# Altium schematic sheet rotor.SchDoc
size A4; SheetNumber: 1; SheetTotal: 1
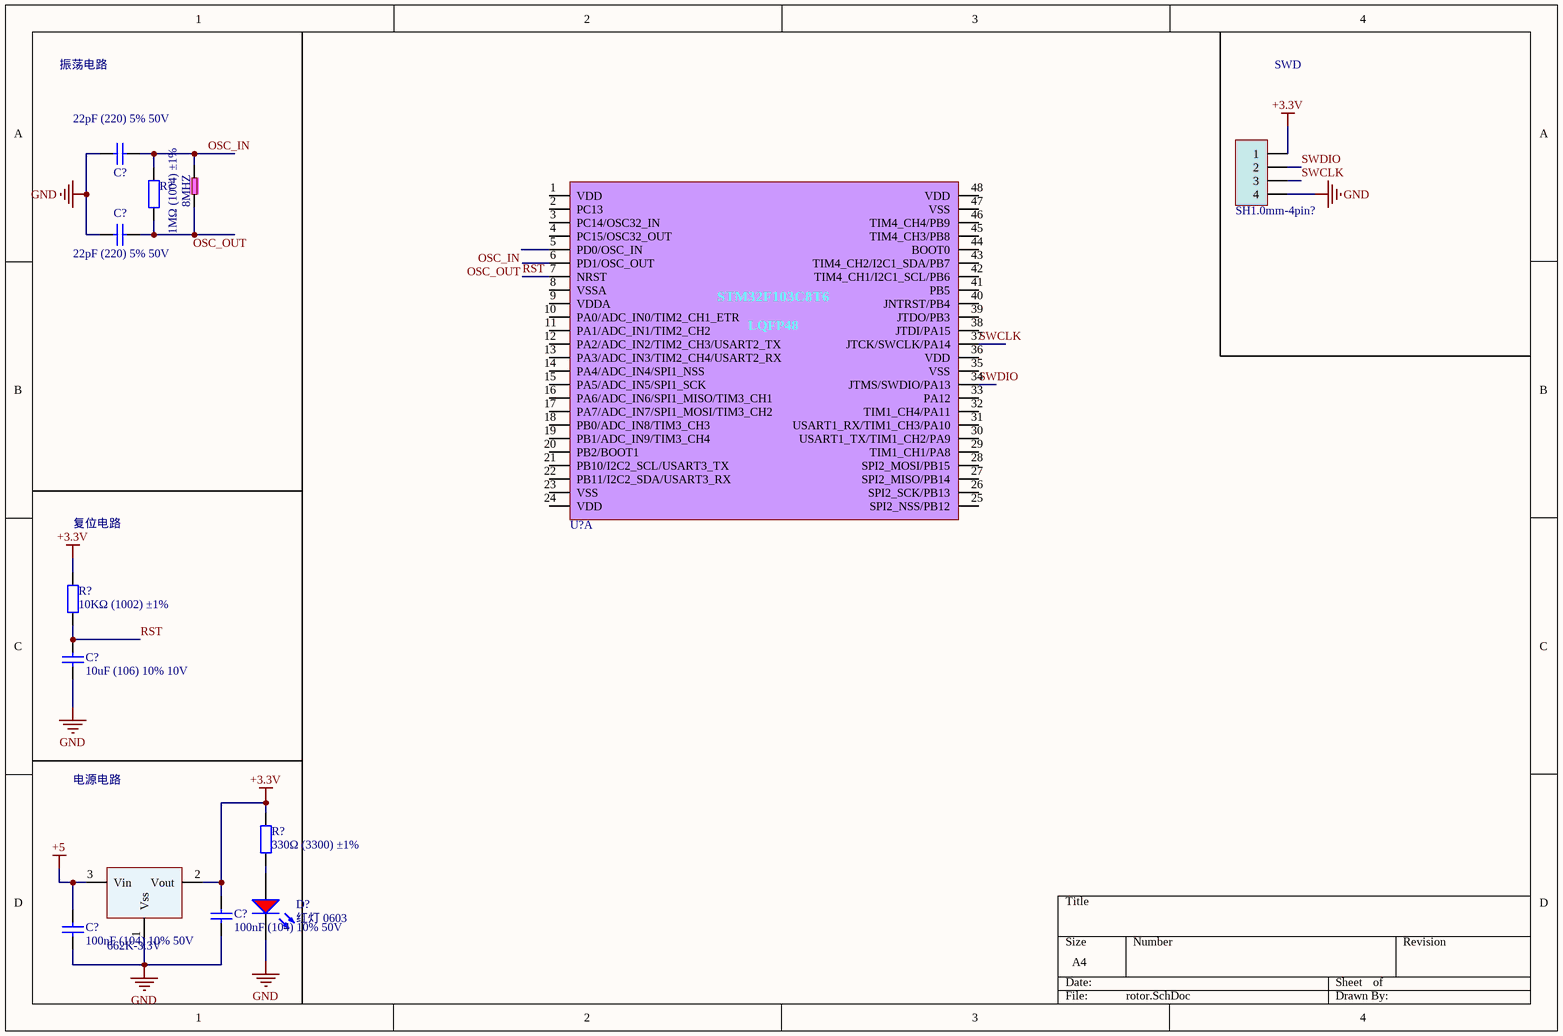
[diagram p0: rotor.SchDoc]

## Parts
(Parts that share a designator on the sheet are numbered #1, #2 ... from top to bottom, then left to right.)
8MHZ  5032-8MHZ  [5032-8MHZ]  (value not drawn)
662K-3.3V  662K-3.3V(SOT-23-3)  [SOT-23-3]  (value not drawn)
C?#1  22pF (220) 5% 50V  [0603_C]
C?#2  22pF (220) 5% 50V  [0603_C]
C?#3  10uF (106) 10% 10V  [0603_C]
C?#4  100nF (104) 10% 50V  [0603_C]
C?#5  100nF (104) 10% 50V  [0603_C]
D?  红灯 0603  [0603_LED_S1]
R?#1  1MΩ (1004) ±1%  [0603_R]
R?#2  10KΩ (1002) ±1%  [0603_R]
R?#3  330Ω (3300) ±1%  [0603_R]
SH1.0mm-4pin?  SH1.0mm-4PIN  [SH1.0mm-4PIN]  (value not drawn)
U?A  STM32F103C8T6  [STM32F103C8T6]  (value not drawn)

## Nets
+3.3V: 662K-3.3V.2(Vout) C?#4.2 R?#2.2 R?#3.2 SH1.0mm-4pin?.1
+5: 662K-3.3V.3(Vin) C?#5.2
GND: 662K-3.3V.1(Vss) C?#1.1 C?#2.1 C?#3.1 C?#4.1 C?#5.1 D?.K SH1.0mm-4pin?.4
OSC_IN: 8MHZ.3 C?#1.2 R?#1.2 U?A.5(PD0/OSC_IN)
OSC_OUT: U?A.6(PD1/OSC_OUT)
RST: C?#3.2 R?#2.1 U?A.7(NRST)
SWCLK: SH1.0mm-4pin?.3 U?A.37(JTCK/SWCLK/PA14)
SWDIO: SH1.0mm-4pin?.2 U?A.34(JTMS/SWDIO/PA13)
Net8MHZ_1: 8MHZ.1 C?#2.2 R?#1.1
NetD?_A: D?.A R?#3.1

Not connected (* = marked no-connect by the designer): U?A 1(VDD) 2(PC13) 3(PC14/OSC32_IN) 4(PC15/OSC32_OUT) 8(VSSA) 9(VDDA) 10(PA0/ADC_IN0/TIM2_CH1_ETR) 11(PA1/ADC_IN1/TIM2_CH2) 12(PA2/ADC_IN2/TIM2_CH3/USART2_TX) 13(PA3/ADC_IN3/TIM2_CH4/USART2_RX) 14(PA4/ADC_IN4/SPI1_NSS) 15(PA5/ADC_IN5/SPI1_SCK) 16(PA6/ADC_IN6/SPI1_MISO/TIM3_CH1) 17(PA7/ADC_IN7/SPI1_MOSI/TIM3_CH2) 18(PB0/ADC_IN8/TIM3_CH3) 19(PB1/ADC_IN9/TIM3_CH4) 20(PB2/BOOT1) 21(PB10/I2C2_SCL/USART3_TX) 22(PB11/I2C2_SDA/USART3_RX) 23(VSS) 24(VDD) 25(SPI2_NSS/PB12) 26(SPI2_SCK/PB13) 27(SPI2_MISO/PB14) 28(SPI2_MOSI/PB15) 29(TIM1_CH1/PA8) 30(USART1_TX/TIM1_CH2/PA9) 31(USART1_RX/TIM1_CH3/PA10) 32(TIM1_CH4/PA11) 33(PA12) 35(VSS) 36(VDD) 38(JTDI/PA15) 39(JTDO/PB3) 40(JNTRST/PB4) 41(PB5) 42(TIM4_CH1/I2C1_SCL/PB6) 43(TIM4_CH2/I2C1_SDA/PB7) 44(BOOT0) 45(TIM4_CH3/PB8) 46(TIM4_CH4/PB9) 47(VSS) 48(VDD)

## Notes on the sheet
- 振荡电路
- SWD
- 复位电路
- 电源电路
- Labels drawn without touching a wire or pin: OSC_OUT
- (in symbol STM32F103C8T6) LQFP48

## Library data of the parts
C?#1 C?#2 = 0603 22pF (220) 5% 50V: 贴片电容; ComponentLink1Description: 供应商链接; ComponentLink1URL: http://www.szlcsc.com/product/details_2005.html; Package: 0603; Supplier: LC; SuppliersPartNumber: C1653
C?#3 = 0603 10uF (106) 10% 10V: 贴片电容; ComponentLink1Description: 供应商链接; ComponentLink1URL: http://www.szlcsc.com/product/details_20411.html; Package: 0603; Supplier: LC; SuppliersPartNumber: C19702
C?#4 C?#5 = 0603 100nF (104) 10% 50V: 贴片电容; ComponentLink1Description: 供应商链接; ComponentLink1URL: http://www.szlcsc.com/product/details_15331.html; Package: 0603; Supplier: LC; SuppliersPartNumber: C14663
D? = 0603 红灯: 发光二极管; ComponentLink1Description: 供应商链接; ComponentLink1URL: http://www.szlcsc.com/product/details_2659.html; Package: 0603; Supplier: LC; SuppliersPartNumber: C2286
R?#1 = 0603 1MΩ (1004) 1%: 贴片电阻; ComponentLink1Description: 供应商链接; ComponentLink1URL: http://www.szlcsc.com/product/details_23662.html; Package: 0603; Supplier: LC; SuppliersPartNumber: C22935
R?#2 = 0603 10KΩ (1002) 1%: 贴片电阻; ComponentLink1Description: 供应商链接; ComponentLink1URL: http://www.szlcsc.com/product/details_26547.html; Package: 0603; Supplier: LC; SuppliersPartNumber: C25804
R?#3 = 0603 330Ω (3300) 1%: 贴片电阻; ComponentLink1Description: 供应商链接; ComponentLink1URL: http://www.szlcsc.com/product/details_23865.html; Package: 0603; Supplier: LC; SuppliersPartNumber: C23138